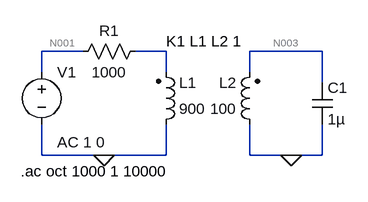
[diagram p0: schematic EX1_CircuitoRC.asc]
EX1_CircuitoRC.asc, the LTspice schematic file:
Version 4
SHEET 1 880 680
WIRE -48 32 -112 32
WIRE 80 32 32 32
WIRE 320 32 208 32
WIRE -112 64 -112 32
WIRE 80 64 80 32
WIRE 208 64 208 32
WIRE 320 80 320 32
WIRE -112 192 -112 144
WIRE -16 192 -112 192
WIRE 80 192 80 144
WIRE 80 192 -16 192
WIRE 208 192 208 144
WIRE 272 192 208 192
WIRE 320 192 320 144
WIRE 320 192 272 192
FLAG -16 192 0
FLAG 272 192 0
SYMBOL voltage -112 48 R0
WINDOW 123 24 124 Left 2
WINDOW 39 0 0 Left 0
SYMATTR Value2 AC 1 0
SYMATTR InstName V1
SYMATTR Value ""
SYMBOL res 48 16 R90
WINDOW 0 0 56 VBottom 2
WINDOW 3 32 56 VTop 2
SYMATTR InstName R1
SYMATTR Value 1000
SYMBOL cap 304 80 R0
SYMATTR InstName C1
SYMATTR Value 1µ
SYMBOL ind2 64 160 M180
WINDOW 0 36 80 Left 2
WINDOW 3 36 40 Left 2
SYMATTR InstName L1
SYMATTR Value 900
SYMBOL ind2 224 160 R180
WINDOW 0 36 80 Left 2
WINDOW 3 36 40 Left 2
SYMATTR InstName L2
SYMATTR Value 100
TEXT 80 16 Left 2 !K1 L1 L2 1
TEXT -144 216 Left 2 !.ac oct 1000 1 10000

The netlist it stands for:
* EX1_CircuitoRC.asc
V1 N001 0 AC 1 0
R1 N002 N001 1000
C1 N003 0 1µ
L1 0 N002 900
L2 0 N003 100
K1 L1 L2 1
.ac oct 1000 1 10000
.backanno
.end

* Results of the author's LTspice run, read from the files saved beside the schematic
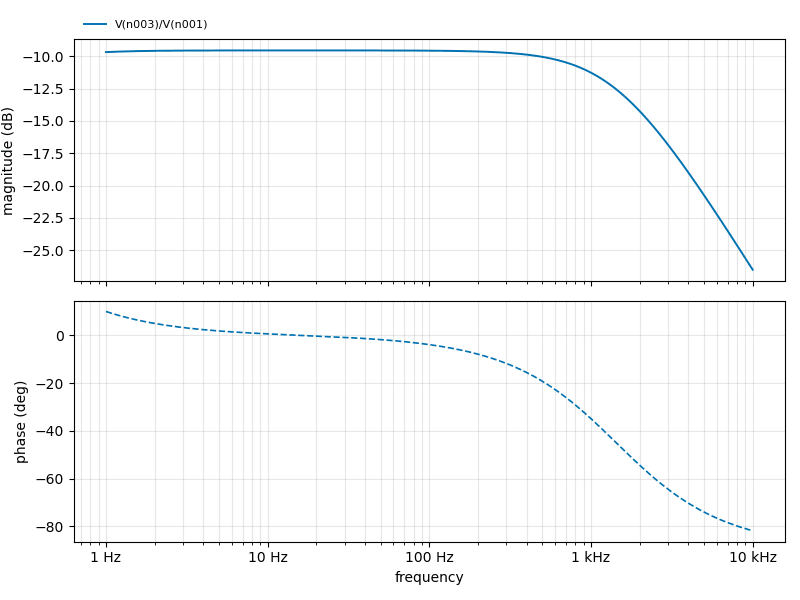
[diagram p1: AC Analysis of EX1_CircuitoRC.asc, plotted from the saved traces]
* AC Analysis, 1 run:
*   V(n003)/V(n001): -9.68 dB at 1 Hz, -26.51 dB at 10 kHz, peak -9.54 dB at 15.91 Hz, 3 dB below the peak at 1.433 kHz